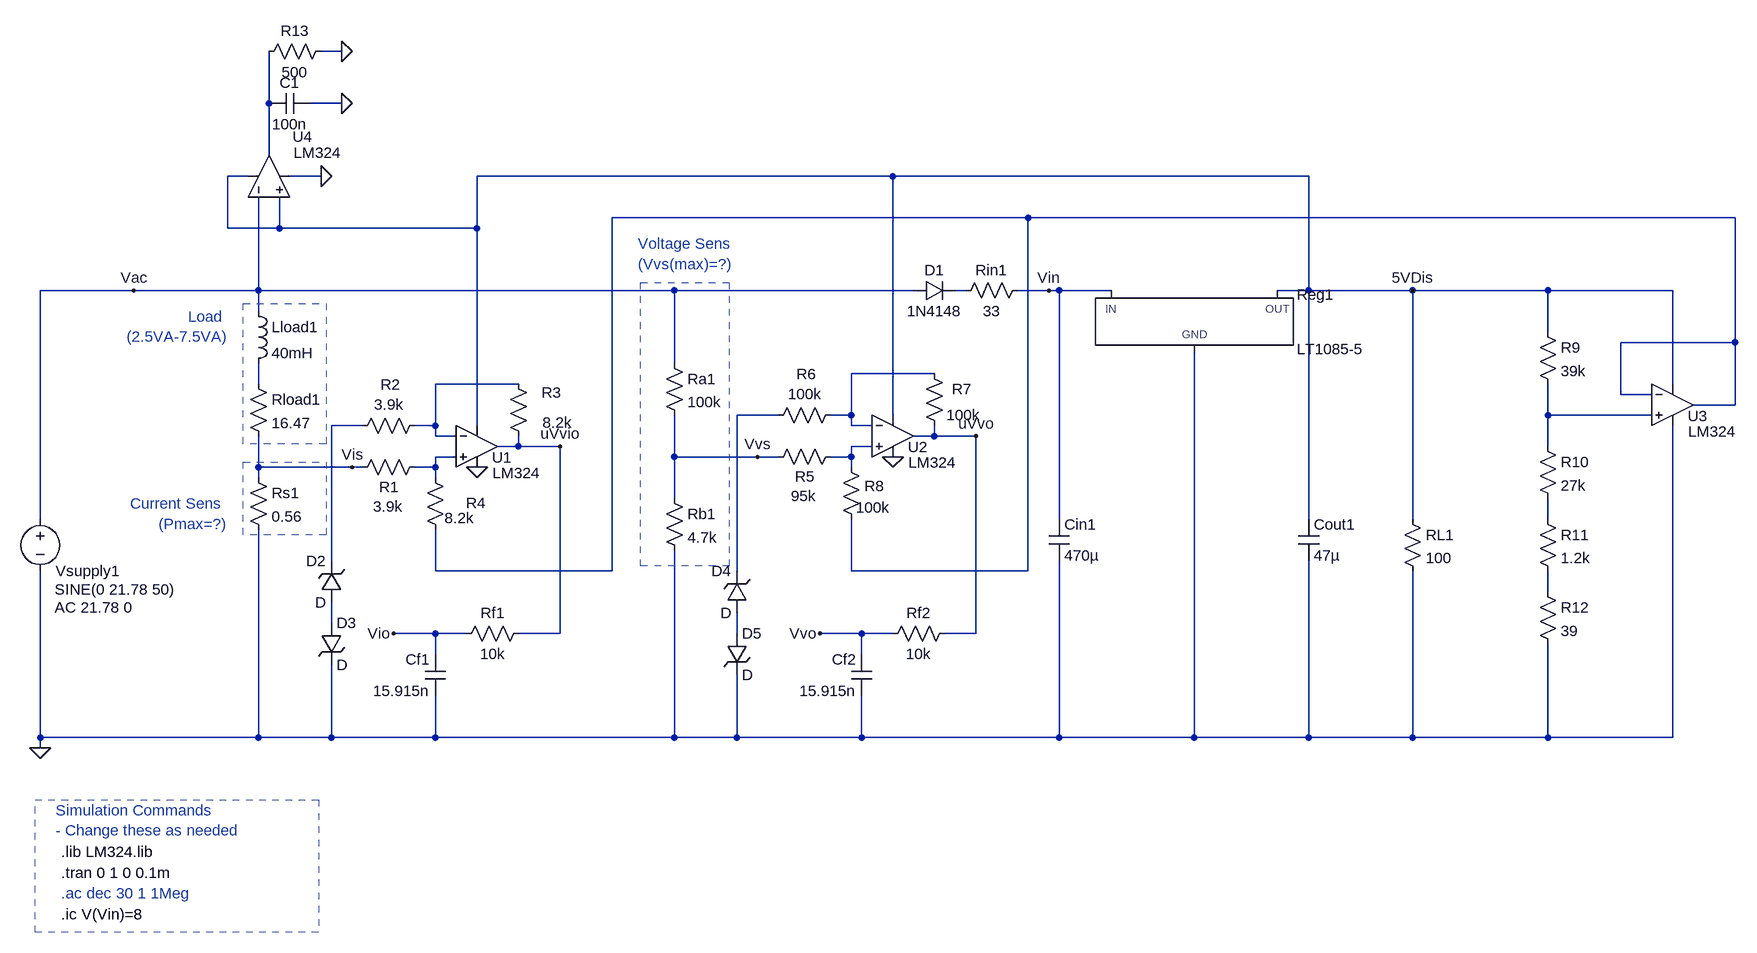
[diagram p0: schematic Schematic.asc]
Schematic.asc, the LTspice schematic file:
Version 4
SHEET 1 3572 1552
WIRE 928 192 896 192
WIRE 816 272 816 192
WIRE 928 272 880 272
WIRE 816 352 816 272
WIRE 784 384 752 384
WIRE 896 384 848 384
WIRE 1776 384 1136 384
WIRE 2416 384 1776 384
WIRE 1984 448 1344 448
WIRE 3072 448 1984 448
WIRE 752 464 752 384
WIRE 832 464 832 416
WIRE 832 464 752 464
WIRE 1136 464 1136 384
WIRE 1136 464 832 464
WIRE 608 560 464 560
WIRE 800 560 800 416
WIRE 800 560 608 560
WIRE 1440 560 800 560
WIRE 1808 560 1440 560
WIRE 1888 560 1872 560
WIRE 2016 560 1968 560
WIRE 2032 560 2016 560
WIRE 2112 560 2032 560
WIRE 2416 560 2416 384
WIRE 2416 560 2368 560
WIRE 2576 560 2416 560
WIRE 2784 560 2576 560
WIRE 2976 560 2784 560
WIRE 800 592 800 560
WIRE 2784 624 2784 560
WIRE 3072 640 3072 448
WIRE 3072 640 2896 640
WIRE 1440 672 1440 560
WIRE 1840 688 1712 688
WIRE 800 704 800 672
WIRE 1200 704 1072 704
WIRE 2976 704 2976 560
WIRE 2896 720 2896 640
WIRE 2944 720 2896 720
WIRE 3072 736 3072 640
WIRE 3072 736 3008 736
WIRE 1600 752 1536 752
WIRE 1712 752 1712 688
WIRE 1712 752 1680 752
WIRE 1776 752 1776 384
WIRE 2784 752 2784 704
WIRE 2944 752 2784 752
WIRE 960 768 912 768
WIRE 1072 768 1072 704
WIRE 1072 768 1040 768
WIRE 1136 768 1136 464
WIRE 1712 768 1712 752
WIRE 1744 768 1712 768
WIRE 1072 784 1072 768
WIRE 1104 784 1072 784
WIRE 1840 784 1840 768
WIRE 1840 784 1808 784
WIRE 1904 784 1840 784
WIRE 1200 800 1200 784
WIRE 1200 800 1168 800
WIRE 1264 800 1200 800
WIRE 1744 800 1712 800
WIRE 2784 800 2784 752
WIRE 1104 816 1072 816
WIRE 1440 816 1440 752
WIRE 1568 816 1440 816
WIRE 1600 816 1568 816
WIRE 1712 816 1712 800
WIRE 1712 816 1680 816
WIRE 800 832 800 784
WIRE 944 832 800 832
WIRE 960 832 944 832
WIRE 1072 832 1072 816
WIRE 1072 832 1040 832
WIRE 1712 832 1712 816
WIRE 800 848 800 832
WIRE 1072 848 1072 832
WIRE 1440 880 1440 816
WIRE 464 912 464 560
WIRE 2032 912 2032 560
WIRE 2416 912 2416 560
WIRE 2576 912 2576 560
WIRE 2784 912 2784 880
WIRE 912 976 912 768
WIRE 1072 992 1072 928
WIRE 1344 992 1344 448
WIRE 1344 992 1072 992
WIRE 1536 992 1536 752
WIRE 1712 992 1712 912
WIRE 1984 992 1984 448
WIRE 1984 992 1712 992
WIRE 2784 1024 2784 992
WIRE 912 1072 912 1040
WIRE 1072 1088 1008 1088
WIRE 1120 1088 1072 1088
WIRE 1264 1088 1264 800
WIRE 1264 1088 1200 1088
WIRE 1536 1088 1536 1056
WIRE 1728 1088 1664 1088
WIRE 1776 1088 1728 1088
WIRE 1904 1088 1904 784
WIRE 1904 1088 1856 1088
WIRE 1072 1120 1072 1088
WIRE 1728 1120 1728 1088
WIRE 464 1248 464 992
WIRE 800 1248 800 928
WIRE 800 1248 464 1248
WIRE 912 1248 912 1136
WIRE 912 1248 800 1248
WIRE 1072 1248 1072 1184
WIRE 1072 1248 912 1248
WIRE 1440 1248 1440 960
WIRE 1440 1248 1072 1248
WIRE 1536 1248 1536 1152
WIRE 1536 1248 1440 1248
WIRE 1728 1248 1728 1184
WIRE 1728 1248 1536 1248
WIRE 2032 1248 2032 976
WIRE 2032 1248 1728 1248
WIRE 2240 1248 2240 656
WIRE 2240 1248 2032 1248
WIRE 2416 1248 2416 976
WIRE 2416 1248 2240 1248
WIRE 2576 1248 2576 992
WIRE 2576 1248 2416 1248
WIRE 2784 1248 2784 1104
WIRE 2784 1248 2576 1248
WIRE 2976 1248 2976 768
WIRE 2976 1248 2784 1248
WIRE 464 1264 464 1248
FLAG 608 560 Vac
FLAG 944 832 Vis
FLAG 464 1264 0
FLAG 1136 832 0
FLAG 1776 816 0
FLAG 1568 816 Vvs
FLAG 2576 560 5VDis
FLAG 2016 560 Vin
FLAG 1664 1088 Vvo
FLAG 1008 1088 Vio
FLAG 1264 800 uVvio
FLAG 1904 784 uVvo
FLAG 896 384 0
FLAG 928 192 0
FLAG 928 272 0
SYMBOL voltage 464 896 R0
WINDOW 0 24 96 Left 2
WINDOW 3 22 124 Left 2
WINDOW 123 22 152 Left 2
WINDOW 39 0 0 Left 0
SYMATTR InstName Vsupply1
SYMATTR Value SINE(0 21.78 50)
SYMATTR Value2 AC 21.78 0
SYMBOL res 784 688 R0
SYMATTR InstName Rload1
SYMATTR Value 16.47
SYMBOL ind 784 576 R0
SYMATTR InstName Lload1
SYMATTR Value 40mH
SYMBOL res 784 832 R0
SYMATTR InstName Rs1
SYMATTR Value 0.56
SYMBOL res 1424 656 R0
SYMATTR InstName Ra1
SYMATTR Value 100k
SYMBOL res 1424 864 R0
SYMATTR InstName Rb1
SYMATTR Value 4.7k
SYMBOL Opamps/opamp2 1136 736 R0
WINDOW 0 23 81 Left 2
WINDOW 3 24 105 Left 2
SYMATTR InstName U1
SYMATTR Value LM324
SYMBOL res 1056 816 R90
WINDOW 0 62 55 VBottom 2
WINDOW 3 61 57 VTop 2
SYMATTR InstName R1
SYMATTR Value 3.9k
SYMBOL res 1056 752 R90
WINDOW 0 -32 53 VBottom 2
WINDOW 3 -32 55 VTop 2
SYMATTR InstName R2
SYMATTR Value 3.9k
SYMBOL res 1216 800 R180
WINDOW 0 -50 83 Left 2
WINDOW 3 -67 37 Left 2
SYMATTR InstName R3
SYMATTR Value 8.2k
SYMBOL res 1088 944 R180
WINDOW 0 -62 57 Left 2
WINDOW 3 -44 34 Left 2
SYMATTR InstName R4
SYMATTR Value 8.2k
SYMBOL res 1104 1104 R270
WINDOW 0 32 56 VTop 2
WINDOW 3 0 56 VBottom 2
SYMATTR InstName Rf1
SYMATTR Value 10k
SYMBOL cap 1088 1184 R180
WINDOW 0 24 56 Left 2
WINDOW 3 24 8 Left 2
SYMATTR InstName Cf1
SYMATTR Value 15.915n
SYMBOL Opamps/opamp2 1776 720 R0
WINDOW 0 23 81 Left 2
WINDOW 3 24 105 Left 2
SYMATTR InstName U2
SYMATTR Value LM324
SYMBOL res 1696 800 R90
WINDOW 0 62 55 VBottom 2
WINDOW 3 61 57 VTop 2
SYMATTR InstName R5
SYMATTR Value 95k
SYMBOL res 1696 736 R90
WINDOW 0 -32 53 VBottom 2
WINDOW 3 -32 55 VTop 2
SYMATTR InstName R6
SYMATTR Value 100k
SYMBOL res 1856 784 R180
WINDOW 0 -42 72 Left 2
WINDOW 3 -55 32 Left 2
SYMATTR InstName R7
SYMATTR Value 100k
SYMBOL res 1728 928 R180
WINDOW 0 -35 67 Left 2
WINDOW 3 -44 34 Left 2
SYMATTR InstName R8
SYMATTR Value 100k
SYMBOL PowerProducts/LT1085-5 2240 560 R0
SYMATTR InstName Reg1
SYMBOL res 2560 896 R0
SYMATTR InstName RL1
SYMATTR Value 100
SYMBOL res 1984 544 R90
WINDOW 0 0 56 VBottom 2
WINDOW 3 32 56 VTop 2
SYMATTR InstName Rin1
SYMATTR Value 33
SYMBOL diode 1808 576 R270
WINDOW 0 32 32 VTop 2
WINDOW 3 0 32 VBottom 2
SYMATTR InstName D1
SYMATTR Value 1N4148
SYMBOL cap 2016 912 R0
SYMATTR InstName Cin1
SYMATTR Value 470µ
SYMATTR SpiceLine Rser=0.001
SYMBOL cap 2400 912 R0
SYMATTR InstName Cout1
SYMATTR Value 47µ
SYMATTR SpiceLine Rser=0.001
SYMBOL res 1760 1104 R270
WINDOW 0 32 56 VTop 2
WINDOW 3 0 56 VBottom 2
SYMATTR InstName Rf2
SYMATTR Value 10k
SYMBOL cap 1744 1184 R180
WINDOW 0 24 56 Left 2
WINDOW 3 24 8 Left 2
SYMATTR InstName Cf2
SYMATTR Value 15.915n
SYMBOL Opamps/opamp2 2976 672 R0
WINDOW 0 23 81 Left 2
WINDOW 3 24 105 Left 2
SYMATTR InstName U3
SYMATTR Value LM324
SYMBOL res 2768 608 R0
SYMATTR InstName R9
SYMATTR Value 39k
SYMBOL res 2768 784 R0
SYMATTR InstName R10
SYMATTR Value 27k
SYMBOL res 2768 896 R0
SYMATTR InstName R11
SYMATTR Value 1.2k
SYMBOL res 2768 1008 R0
SYMATTR InstName R12
SYMATTR Value 39
SYMBOL zener 928 1040 R180
WINDOW 0 24 64 Left 2
WINDOW 3 24 0 Left 2
SYMATTR InstName D2
SYMBOL zener 896 1072 R0
SYMATTR InstName D3
SYMBOL zener 1552 1056 R180
WINDOW 0 24 64 Left 2
WINDOW 3 24 0 Left 2
SYMATTR InstName D4
SYMBOL zener 1520 1088 R0
SYMATTR InstName D5
SYMBOL Opamps/opamp2 752 384 R270
WINDOW 0 61 100 VRight 2
WINDOW 3 36 102 VRight 2
SYMATTR InstName U4
SYMATTR Value LM324
SYMBOL res 912 176 R90
WINDOW 0 0 56 VBottom 2
WINDOW 3 32 56 VTop 2
SYMATTR InstName R13
SYMATTR Value 500
SYMBOL cap 880 256 R90
WINDOW 0 0 32 VBottom 2
WINDOW 3 32 32 VTop 2
SYMATTR InstName C1
SYMATTR Value 100n
TEXT 752 600 Right 2 ;Load \n(2.5VA-7.5VA)
TEXT 752 888 Right 2 ;Current Sens \n(Pmax=?)
TEXT 1384 488 Left 2 ;Voltage Sens\n(Vvs(max)=?)
TEXT 496 1488 Left 2 ;.ac dec 30 1 1Meg
TEXT 496 1424 Left 2 !.lib LM324.lib
TEXT 488 1360 Left 2 ;Simulation Commands\n- Change these as needed
TEXT 496 1456 Left 2 !.tran 0 1 0 0.1m
TEXT 496 1520 Left 2 !.ic V(Vin)=8
RECTANGLE Normal 776 580 904 796 2
RECTANGLE Normal 776 824 904 936 2
RECTANGLE Normal 1388 548 1524 984 2
RECTANGLE Normal 456 1344 892 1548 2

The netlist it stands for:
* Schematic.asc
Vsupply1 Vac 0 SINE(0 21.78 50) AC 21.78 0
Rload1 N005 Vis 16.47
Lload1 Vac N005 40mH
Rs1 Vis 0 0.56
Ra1 Vac Vvs 100k
Rb1 Vvs 0 4.7k
XU1 N011 N006 5VDis 0 uVvio LM324  ; pins In+ In- V+ V- OUT
R1 N011 Vis 3.9k
R2 N006 N009 3.9k
R3 uVvio N006 8.2k
R4 N002 N011 8.2k
Rf1 Vio uVvio 10k
Cf1 0 Vio 15.915n
XU2 N010 N004 5VDis 0 uVvo LM324  ; pins In+ In- V+ V- OUT
R5 N010 Vvs 95k
R6 N004 N007 100k
R7 uVvo N004 100k
R8 N002 N010 100k
XReg1 0 5VDis Vin LT1085-5  ; pins GND OUT IN
RL1 5VDis 0 100
Rin1 Vin N003 33
D1 Vac N003 1N4148
Cin1 Vin 0 470µ Rser=0.001
Cout1 5VDis 0 47µ Rser=0.001
Rf2 Vvo uVvo 10k
Cf2 0 Vvo 15.915n
XU3 N008 N002 5VDis 0 N002 LM324  ; pins In+ In- V+ V- OUT
R9 5VDis N008 39k
R10 N008 N012 27k
R11 N012 N013 1.2k
R12 N013 0 39
D2 N014 N009 D
D3 N014 0 D
D4 N015 N007 D
D5 N015 0 D
XU4 5VDis Vac 5VDis 0 N001 LM324  ; pins In+ In- V+ V- OUT
R13 0 N001 500
C1 0 N001 100n
.model D D
.lib standard.dio
* Load
* (2.5VA-7.5VA)
* Current Sens
* (Pmax=?)
* Voltage Sens
* (Vvs(max)=?)
* .ac dec 30 1 1Meg
.lib LM324.lib
* Simulation Commands
* - Change these as needed
.tran 0 1 0 0.1m
.ic V(Vin)=8
.backanno
.end